# EasyEDA schematic SCH_Shreder_2023-07-20.json

## Sheets
1 Sheet_1: TITLE: Shreder; REV: 1.0; Date: 2023-07-20; Sheet: 1/1; Company: Your Company
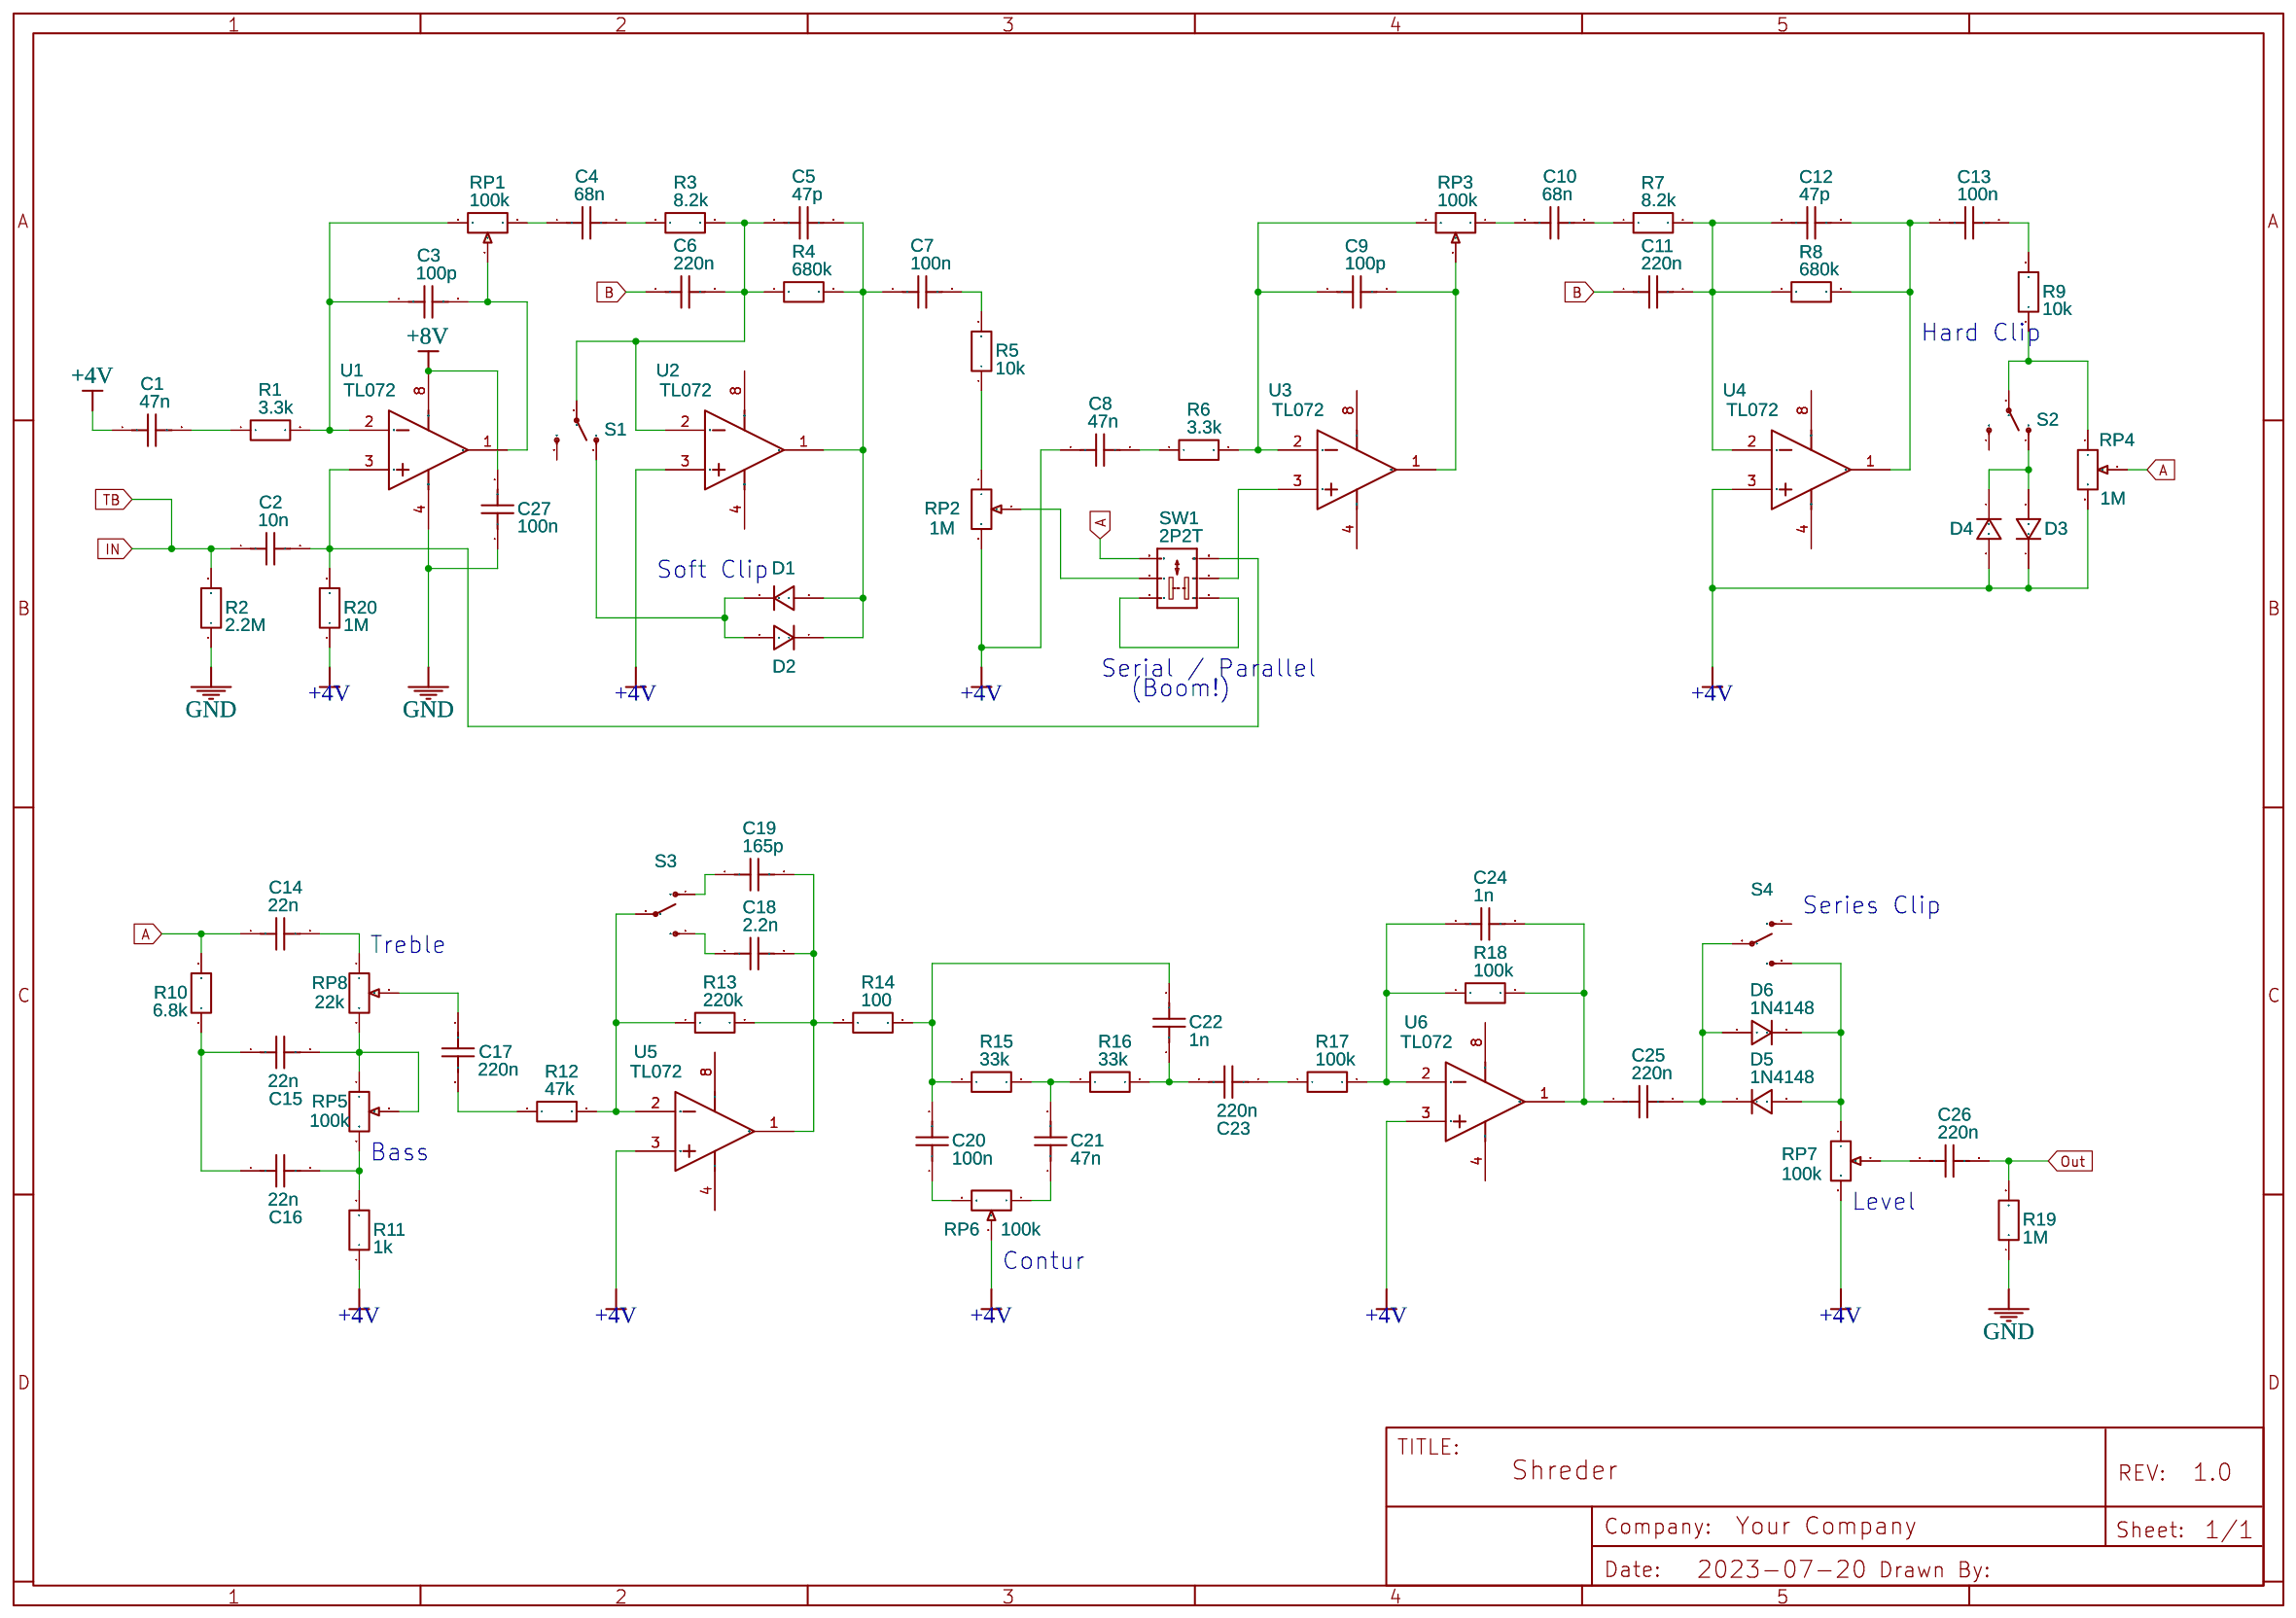
[diagram p0: Sheet_1]
2 Sheet_2: TITLE: Power Supply & True Bypass
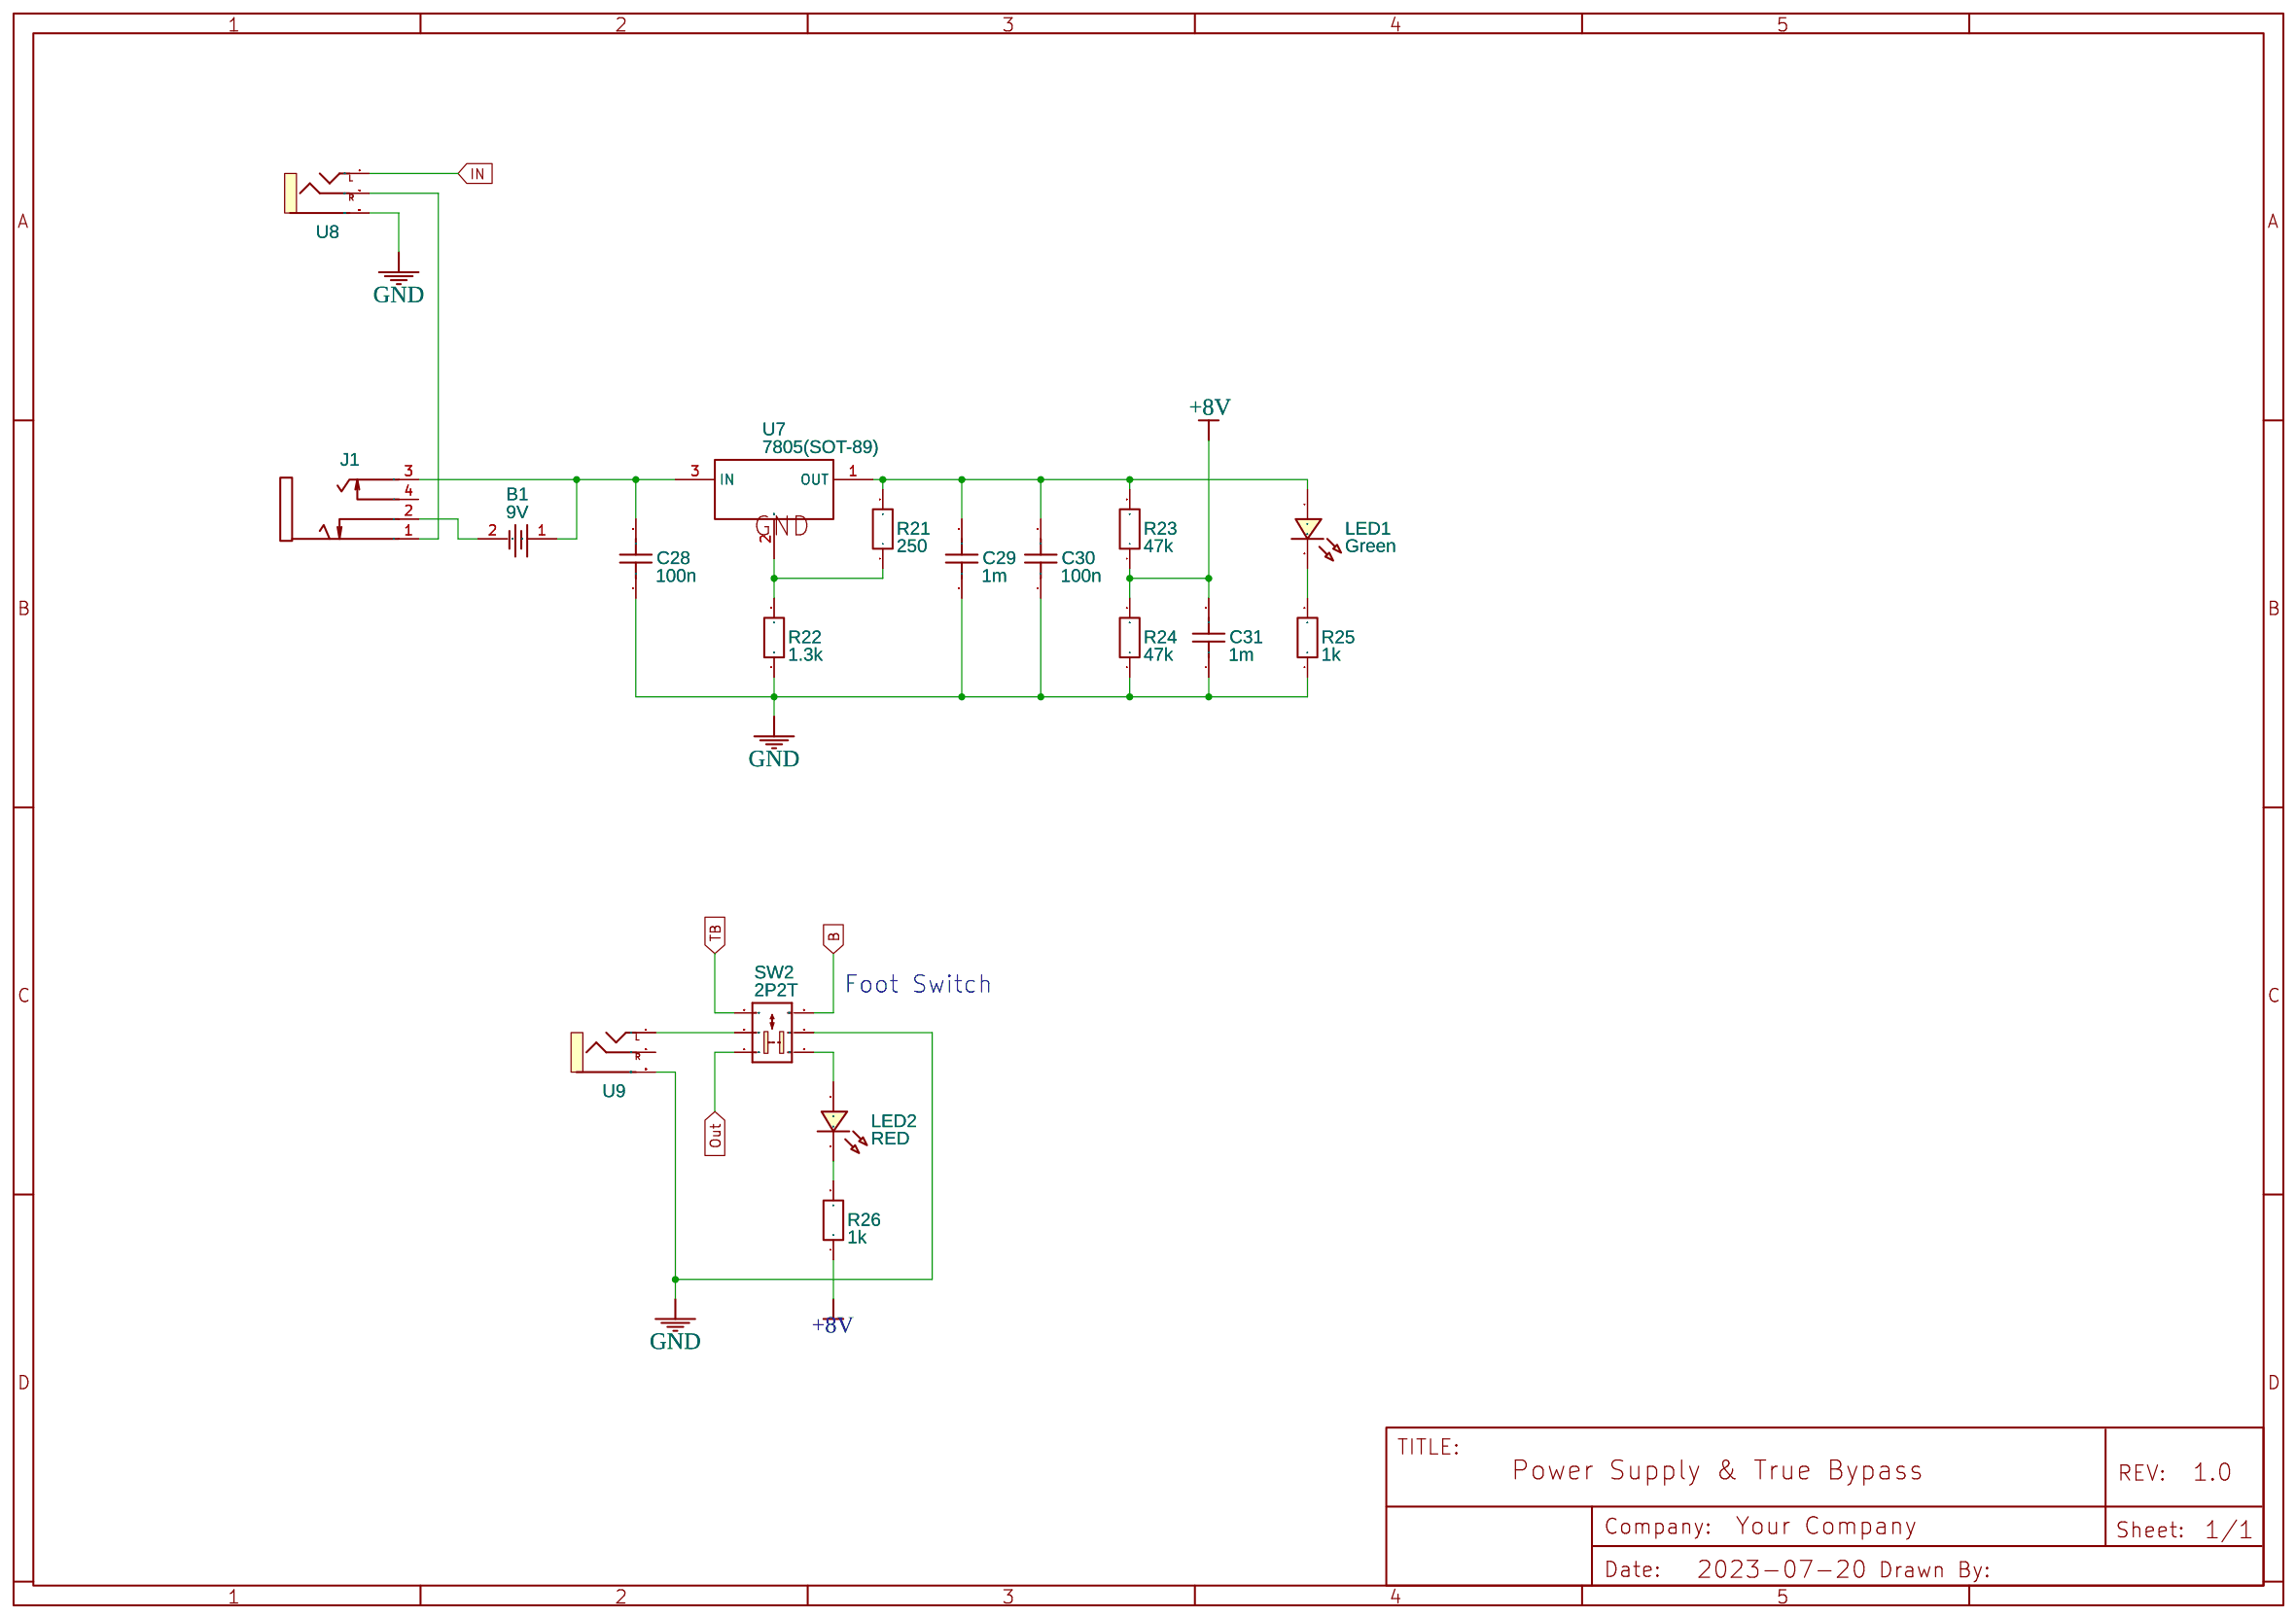
[diagram p1: Sheet_2]

## Parts
sheet Sheet_1
C1  47n  [RAD-0.2]
C2  10n  [RAD-0.2]
C3  100p  [RAD-0.2]
C4  68n  [RAD-0.2]
C5  47p  [RAD-0.2]
C6  220n  [RAD-0.2]
C7  100n  [RAD-0.2]
C8  47n  [RAD-0.2]
C9  100p  [RAD-0.2]
C10  68n  [RAD-0.2]
C11  220n  [RAD-0.2]
C12  47p  [RAD-0.2]
C13  100n  [RAD-0.2]
C14  22n  [RAD-0.2]
C15  22n  [RAD-0.2]
C16  22n  [RAD-0.2]
C17  220n  [RAD-0.2]
C18  2.2n  [RAD-0.2]
C19  165p  [RAD-0.2]
C20  100n  [RAD-0.2]
C21  47n  [RAD-0.2]
C22  1n  [RAD-0.2]
C23  220n  [RAD-0.2]
C24  1n  [RAD-0.2]
C25  220n  [RAD-0.2]
C26  220n  [RAD-0.2]
C27  100n  [RAD-0.2]
D1  1N4148  [DO-35_BD2.0-L4.2-P8.20-D0.5-RD]
D2  1N4148  [DO-35_BD2.0-L4.2-P8.20-D0.5-RD]
D3  1N4148  [DO-35_BD2.0-L4.2-P8.20-D0.5-RD]
D4  1N4148  [DO-35_BD2.0-L4.2-P8.20-D0.5-RD]
D5  1N4148  [DO-35_BD2.0-L4.2-P8.20-D0.5-RD]
D6  1N4148  [DO-35_BD2.0-L4.2-P8.20-D0.5-RD]
R1  3.3k  [R0603]
R2  2.2M  [R0603]
R3  8.2k  [R0603]
R4  680k  [R0603]
R5  10k  [R0603]
R6  3.3k  [R0603]
R7  8.2k  [R0603]
R8  680k  [R0603]
R9  10k  [R0603]
R10  6.8k  [R0603]
R11  1k  [R0603]
R12  47k  [R0603]
R13  220k  [R0603]
R14  100  [R0603]
R15  33k  [R0603]
R16  33k  [R0603]
R17  100k  [R0603]
R18  100k  [R0603]
R19  1M  [R0603]
R20  1M  [R0603]
RP1  100k  [RES-ADJ-TH_3386P]
RP2  1M  [RES-ADJ-TH_3386P]
RP3  100k  [RES-ADJ-TH_3386P]
RP4  1M  [RES-ADJ-TH_3386P]
RP5  100k  [RES-ADJ-TH_3386P]
RP6  100k  [RES-ADJ-TH_3386P]
RP7  100k  [RES-ADJ-TH_3386P]
RP8  22k  [RES-ADJ-TH_3386P]
S1  SWITCH-SPSTPTH_LOCK  [SWITCH-SPDT_LOCK.007S]
S2  SWITCH-SPSTPTH_LOCK  [SWITCH-SPDT_LOCK.007S]
S3  SWITCH-SPSTPTH_LOCK  [SWITCH-SPDT_LOCK.007S]
S4  SWITCH-SPSTPTH_LOCK  [SWITCH-SPDT_LOCK.007S]
SW1  2P2T  [2P2T]
U1  TL072  [TSSOP-8_L4.4-W3.0-P0.65-LS6.4-BL]
U2  TL072  [TSSOP-8_L4.4-W3.0-P0.65-LS6.4-BL]
U3  TL072  [TSSOP-8_L4.4-W3.0-P0.65-LS6.4-BL]
U4  TL072  [TSSOP-8_L4.4-W3.0-P0.65-LS6.4-BL]
U5  TL072  [TSSOP-8_L4.4-W3.0-P0.65-LS6.4-BL]
U6  TL072  [TSSOP-8_L4.4-W3.0-P0.65-LS6.4-BL]
sheet Sheet_2
B1  9V  [BAT-SMD_CR1220-2]
C28  100n  [RAD-0.2]
C29  1m  [RAD-0.2]
C30  100n  [RAD-0.2]
C31  1m  [RAD-0.2]
J1  6.35mm Mono Socket (PCB Mount)  [MONO AUDIO JACK]
LED1  Green  [LED0603_BLUE]
LED2  RED  [LED0603_BLUE]
R21  250  [R0603]
R22  1.3k  [R0603]
R23  47k  [R0603]
R24  47k  [R0603]
R25  1k  [R0603]
R26  1k  [R0603]
SW2  2P2T  [2P2T]
U7  7805(SOT-89)  [SOT-89-3_L4.5-W2.5-P1.50-LS4.2-BR]
U8  AUDIO-JACKSMD2  [AUDIO-JACK-3.5MM-SMD]
U9  AUDIO-JACKSMD2  [AUDIO-JACK-3.5MM-SMD]

## Library data of the parts
C1-C31 = C_RAD-0.2_US: Contributor: LCEDA_Lib
D1-D6 = 1N4148: Supplier: LCSC; Supplier Part: C13769; Manufacturer: STMicroelectronics; Contributor: LCSC
R1-R26 = R_0603_EU: Contributor: LCEDA_Lib
RP1-RP8 = R_3386P_EU: Supplier: LCSC; Contributor: LCEDA_Lib; Value(Ω): 10K
S1-S4 = SWITCH-SPSTPTH_LOCK: SPST Switch; Contributor: Pinoccio
SW1 SW2 = 2P2T: Contributor: Alex710
U1-U6 = TL072HIPWR: Supplier: LCSC; Supplier Part: C4370341; Manufacturer: TI(德州仪器); link: https://atta.szlcsc.com/upload/public/pdf/source/20230221/CF9AD0C7A1EBE0D7819F493A0663F625.pdf; subpart_no: 1
B1 = CR1220-2: Supplier: LCSC; Manufacturer: Q&J; image: //image.lceda.cn/szlcsc/C70381.jpg; Supplier Part: C70381
J1 = 6.35mm Mono Socket (PCB Mount): Supplier: RS-Online; Supplier Part: 449-332; Manufacturer: RS pro; Manufacturer Part: 449-332; Contributor: krmoyle76; link: https://dk.rs-online.com/web/p/jackstik/0449332/
LED1 LED2 = LED-0603_B: Manufacturer: EVERLIGHT(台湾亿光); Manufacturer Part: 19-217/BHC-ZL1M2RY/3T; Supplier Part: C72041; Supplier: LCSC; Contributor: LCEDA_01
U7 = 7805(SOT-89): Supplier: LCSC; Manufacturer: CJ; Manufacturer Part: CJ78L05; image: //image.lceda.cn/szlcsc/C2079.jpg; Supplier Part: C2079; Paste Type: expand; Contributor: LCEDA_Lib
U8 U9 = AUDIO-JACKSMD2: Contributor: mickael9919

## Nets
+4V: C1.1 C8.1 D3.1 D4.2 R11.1 R20.1 RP2.3 RP4.3 RP6.2 RP7.3 U2.3(1IN+) U4.3(1IN+) U5.3(1IN+) U6.3(1IN+)
+8V: C27.2 C31.2 R23.1 R24.2 R26.1 U1.8(VCC+)
GND: C27.1 C28.1 C29.1 C30.1 C31.1 R2.1 R19.1 R22.1 R24.1 R25.1 SW2.2.2 U1.4(VCC-) U8.SLEEVE U9.SLEEVE
A: C14.1 R10.2 RP4.2 SW1.3.1
B: C6.1 C11.1 SW2.3.2
IN: C2.1 R2.2 SW2.3.1 U8.TIP(LEFT)
Out: C26.2 R19.2 SW2.1.1
Net-(B1-1): B1.1 C28.2 J1.3(6) U7.3(IN)
Net-(B1-2): B1.2 J1.2(3)
Net-(C1-2): C1.2 R1.1
Net-(C2-2): C2.2 R20.2 SW1.3.2 U1.3(1IN+)
Net-(C3-1): C3.1 R1.2 RP1.3 U1.2(1IN-)
Net-(C3-2): C3.2 RP1.2 U1.1(1OUT)
Net-(C4-1): C4.1 RP1.1
Net-(C4-2): C4.2 R3.1
Net-(C5-1): C5.1 C6.2 R3.2 R4.1 S1.2(P) U2.2(1IN-)
Net-(C5-2): C5.2 C7.1 D1.2 D2.1 R4.2 U2.1(1OUT)
Net-(C7-2): C7.2 R5.2
Net-(C8-2): C8.2 R6.1
Net-(C9-1): C9.1 R6.2 RP3.3 U3.2(1IN-)
Net-(C9-2): C9.2 RP3.2 U3.1(1OUT)
Net-(C10-1): C10.1 RP3.1
Net-(C10-2): C10.2 R7.1
Net-(C11-2): C11.2 C12.1 R7.2 R8.1 U4.2(1IN-)
Net-(C12-2): C12.2 C13.1 R8.2 U4.1(1OUT)
Net-(C13-2): C13.2 R9.2
Net-(C14-2): C14.2 RP8.1
Net-(C15-1): C15.1 C16.1 R10.1
Net-(C15-2): C15.2 RP5.1 RP5.2 RP8.3
Net-(C16-2): C16.2 R11.2 RP5.3
Net-(C17-1): C17.1 RP8.2
Net-(C17-2): C17.2 R12.1
Net-(C18-1): C18.1 S3.3(S)
Net-(C18-2): C18.2 C19.2 R13.2 R14.1 U5.1(1OUT)
Net-(C19-1): C19.1 S3.1(O)
Net-(C20-1): C20.1 RP6.3
Net-(C20-2): C20.2 C22.2 R14.2 R15.1
Net-(C21-1): C21.1 RP6.1
Net-(C21-2): C21.2 R15.2 R16.1
Net-(C22-1): C22.1 C23.2 R16.2
Net-(C23-1): C23.1 R17.1
Net-(C24-1): C24.1 R17.2 R18.1 U6.2(1IN-)
Net-(C24-2): C24.2 C25.1 R18.2 U6.1(1OUT)
Net-(C25-2): C25.2 D5.1 D6.2 S4.2(P)
Net-(C26-1): C26.1 RP7.2
Net-(C29-2): C29.2 C30.2 LED1.1 R21.2 R23.2 U7.1(OUT)
Net-(D1-1): D1.1 D2.2 S1.1(O)
Net-(D3-2): D3.2 D4.1 S2.1(O)
Net-(D5-2): D5.2 D6.1 RP7.1 S4.3(S)
Net-(J1-1): J1.1(2) U8.RING(RIGHT)
Net-(LED1-2): LED1.2 R25.2
Net-(LED2-1): LED2.1 SW2.1.2
Net-(LED2-2): LED2.2 R26.2
Net-(R5-1): R5.1 RP2.1
Net-(R9-1): R9.1 RP4.1 S2.2(P)
Net-(R12-2): R12.2 R13.1 S3.2(P) U5.2(1IN-)
Net-(R21-1): R21.1 R22.2 U7.2(GND)
Net-(RP2-2): RP2.2 SW1.2.1
Net-(SW1-1.1): SW1.1.1 SW1.1.2
Net-(SW1-2.2): SW1.2.2 U3.3(1IN+)
Net-(SW2-2.1): SW2.2.1 U9.TIP(LEFT)

Not connected (* = marked no-connect by the designer): J1 4(7); S1 3(S); S2 3(S); S4 1(O); U2 4(VCC-) 8(VCC+); U3 4(VCC-) 8(VCC+); U4 4(VCC-) 8(VCC+); U5 4(VCC-) 8(VCC+); U6 4(VCC-) 8(VCC+); U9 RING(RIGHT)

## Notes on the sheets
sheet 1
- Hard Clip
- Soft Clip
- Serial / Parallel
- (Boom!)
- Series Clip
- Treble
- Bass
- Level
- Contur
sheet 2
- Foot Switch
